# EAGLE design shema (EAGLE 7.2.0)
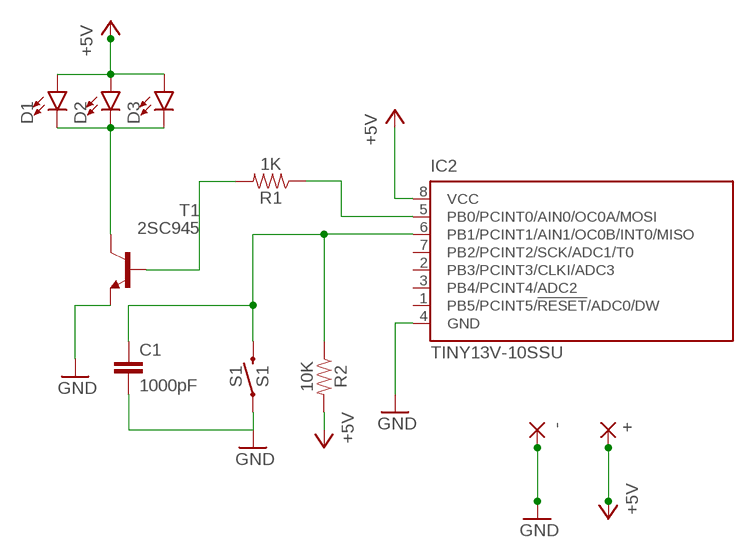
[diagram p0: schematic, sheet 1]

## Parts
+  2,54/0,8  [2,54/0,8]
-  2,54/0,8  [2,54/0,8]
C1  1000pF  560PF-0603-50V-5%  [0603]
D1  LED-3MM-NO_SILK  [LED_3MM-NS]
D2  LED-3MM-NO_SILK  [LED_3MM-NS]
D3  LED-3MM-NO_SILK  [LED_3MM-NS]
IC2  TINY13V-10SSU  [8S1]
R1  1K  2MOHMS-0603-1/10W-1%  [0603]
R2  10K  2MOHMS-0603-1/10W-1%  [0603]
S1  S1  MOMENTARY-SWITCH-SPST-SMD-4.5MM  [TACTILE_SWITCH_SMD_4.5MM]
T1  2SC945  [TO92-ECB]

## Nets
+5V: +.1(P) D1.A D2.A D3.A IC2.8(VCC) R2.2
GND: -.1(P) C1.2 IC2.4(GND) S1.2 S1.3 T1.E
N$1: IC2.5(PB0/PCINT0/AIN0/OC0A/MOSI) R1.1
N$2: C1.1 IC2.6(PB1/PCINT1/AIN1/OC0B/INT0/MISO) R2.1 S1.1 S1.4
N$3: R1.2 T1.B
N$6: D1.K(C) D2.K(C) D3.K(C) T1.C
Unconnected: IC2.1(PB5/PCINT5/!RESET!/ADC0/DW) IC2.2(PB3/PCINT3/CLKI/ADC3) IC2.3(PB4/PCINT4/ADC2) IC2.7(PB2/PCINT2/SCK/ADC1/T0)

## Library data of the parts
+ - = wirepad:2,54/0,8: THROUGH-HOLE PAD
C1 = SparkFun-Capacitors:560PF: 0.56nF/560pF ceramic capacitors A capacitor is a passive two-terminal electrical component used to store electrical energy temporarily in an electric field.; PROD_ID: CAP-08749; VALUE: 560pF
D1-D3 = SparkFun-LED:LED: LED (Generic) Standard schematic elements and footprints for 5mm, 3mm, 1206, and 0603 sized LEDs. Generic LEDs with no color specified.
IC2 = atmel:TINY13: 8-bit AVR Microcontroller with 1K Bytes In-System Programmable Flash Source: http://www.atmel.com/dyn/resources/prod_documents/2535S.pdf; MPN: ATTINY13V-10SSU; OC_FARNELL: 1455135; OC_NEWARK: 58M3773
R1 R2 = SparkFun-Resistors:2MOHMS: 2MΩ resistor A resistor is a passive two-terminal electrical component that implements electrical resistance as a circuit element. Resistors act to reduce current flow, and, at the same time, act to lower voltage levels within circuits. - Wikipedia; PROD_ID: RES-10054; VALUE: 2.0M
S1 = SparkFun-Switches:MOMENTARY-SWITCH-SPST: Momentary Switch (Pushbutton) - SPST Normally-open (NO) SPST momentary switches (buttons, pushbuttons). Variants PTH-12MM - 12mm square, through-hole Momentary Pushbutton Switch - 12mm Square <https://www.sparkfun.com/products/9190> (COM-09190) PTH-6.0MM, PTH-6.0MM-KIT - 6.0mm square, through-hole Mini Pushbutton Switch <https://www.sparkfun.com/products/97> (COM-00097) KIT package intended for soldering kit's - only one side of pads' copper is exposed. PTH-RIGHT-ANGLE-KIT - Right-angle, through-hole Right Angle Tactile Button <https://www.sparkfun.com/products/10791> - Used on SparkFun BigTime Watch Kit <https://www.sparkfun.com/products/11734> SMD-12MM - 12mm square, surface-mount Tactile Button - SMD (12mm) <https://www.sparkfun.com/products/12993> (COM-12993) Used on SparkFun PicoBoard <https://www.sparkfun.com/products/11888> SMD-4.5MM - 4.5mm Square Trackball Switch Used on SparkFun Blackberry Trackballer Breakout <https://www.sparkfun.com/products/13169> SMD-4.6MMX2.8MM - 4.60mm x 2.80mm, surface mount Used on SparkFun SAMD21 Mini Breakout <https://www.sparkfun.com/products/13664> SMD-5.2MM, SMD-5.2-REDUNDANT - 5.2mm square, surface-mount Mini Pushbutton Switch - SMD <https://www.sparkfun.com/products/8720> (COM-08720) Used on Arduino Pro Mini <https://www.sparkfun.com/products/11114> REDUNDANT package connects both switch circuits together SMD-6.0X3.5MM - 6.0 x 3.5mm, surface mount Momentary Reset Switch SMD <https://www.sparkfun.com/products/8229> (COM-08229) SMD-6.2MM-TALL - 6.2mm square, surface mount Tactile Button - SMD (6mm) <https://www.sparkfun.com/products/12992> Used on SparkFun Digital Sandbox <https://www.sparkfun.com/products/12651> SMD-RIGHT-ANGLE - Right-angle, surface mount Used on SparkFun Block for Intel® Edison - Arduino <https://www.sparkfun.com/products/13036>; PROD_ID: SWCH-09213
T1 = transistor:2SC945: NPN Silicon Epitaxial Planar Transistor Source: SEMTECH ELECTRONICS LTD. ... 2SC945 2.pdf

## Board
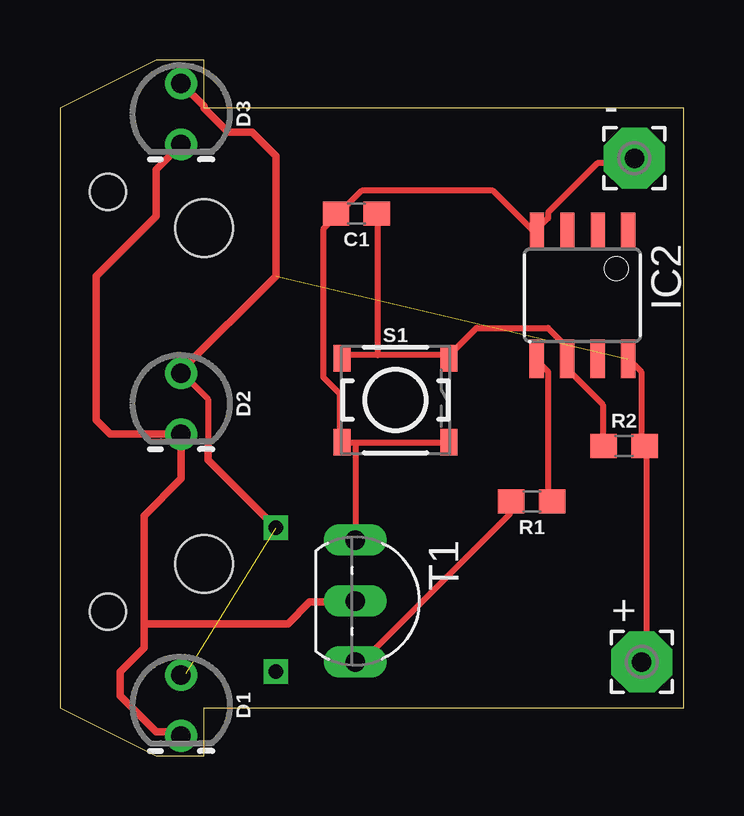
[diagram p1: board, top side]

Size 26 x 29 mm. Coordinates in mm from the lower left corner, seen from the top.
Outline: 0,2 4,0 6,0 6,2 26,2 26,27 6,27 6,29 4,29 0,27 0,2
Copper layers (1*16): Top 0.035mm / dielectric 1.5mm / Bottom 0.035mm
Design rules "default": minimum track width 10mil, minimum drill 24mil, track to track 8mil, track to pad 8mil, pad to pad 8mil, via to via 8mil, smd to smd 8mil, copper to edge 40mil, drill to drill 8mil, minimum pad ring 10mil, minimum via ring 8mil, stop-mask expansion 4mil, vias tented up to drill 0mil, thermal gap 10mil
Holes 2.4 mm at 6,22 6,8
Holes 1.5 mm at 2,23.5 2,6

### Footprints (pad centres in the part's own frame; a part is rotated, then mirrored left to right if it is on the bottom)
2,54/0,8 = drill 0.813 pad 2.54 octagon: 1 0,0
0603 = smd 1.1 x 1: 1 -0.85,0; 2 0.85,0
LED_3MM-NS = drill 0.813: A -1.27,0; K 1.27,0
8S1 = smd 0.6 x 1.6: 1 -1.905,-2.654; 2 -0.645,-2.654; 3 0.625,-2.654; 4 1.895,-2.654; 5 1.905,2.654; 6 0.635,2.654; 7 -0.635,2.654; 8 -1.905,2.654
TACTILE_SWITCH_SMD_4.5MM = smd 0.7 x 1.1: 1 2.225,1.75; 2 2.225,-1.75; 3 -2.225,-1.75; 4 -2.225,1.75
TO92-ECB = drill 0.813 long: B 2.54,0; C 0,0; E -2.54,0

### Placement (x,y rotation side)
+  24.26,3.9 0 top
-  23.95,24.9 0 top
C1  12.36,22.6 180 top
D1  5.05,2.09 270 top
D2  5.05,14.67 270 top
D3  5.05,26.75 270 top
IC2  21.78,19.19 180 top
R1  19.67,10.6 180 top
R2  23.52,12.9 0 top
S1  13.99,14.82 0 top
T1  12.31,6.44 270 top

### Tracks (layer width: path | path; a pad name or v marks a point on that pad's centre or on a via)
+5V  (2 unrouted)
  Top 0.254: 6.17,13.03 6.17,14.86 5.26,15.77 D2.A | 5.26,3.43 D1.A | IC2.8 23.77,16.46 24.23,16 24.23,13.03 R2.2 24.46,12.8 24.46,4.12 +.1
  Top 0.305: D2.A 5.05,16.05 9,20 9,25 8,26 7,26 6,27 6,27.07 D3.A | 6.17,13.03 6.17,12.33 9,9.5
GND
  Top 0.254: 12.34,13.03 16,13.03 S1.2 | 12.34,13.03 11.89,13.03 S1.3 11.66,13.26 11.66,15.09 10.97,15.77 10.97,21.95 11.43,22.4 C1.2 11.66,22.63 12.57,23.55 18.06,23.55 19.66,21.95 IC2.4 19.89,21.95 20.34,22.4 20.34,22.63 22.4,24.69 23.77,24.69 -.1 | 12.34,13.03 12.34,9.14 T1.E
N$1
  Top 0.254: R1.1 20.34,10.74 20.34,16 19.89,16.46 IC2.5
N$2
  Top 0.254: R2.1 22.63,13.03 22.63,14.63 21.26,16 21.26,16.46 IC2.6 21.03,16.69 21.03,17.14 20.34,17.83 17.37,17.83 16.23,16.69 S1.1 16,16.69 13.26,16.69 | 13.26,16.69 11.89,16.69 S1.4 | 13.26,16.69 13.26,22.4 C1.1
N$3
  Top 0.254: R1.2 18.75,10.52 18.75,10.06 12.8,4.12 12.34,4.12 T1.B
N$4  (via drill 0.6)
  other vias: 9,3.5
N$5  (via drill 0.6)
  other vias: 9,9.5
N$6
  Top 0.254: 5.26,13.26 D2.K | 12.12,6.4 T1.C
  Top 0.305: 3.5,5.5 3.5,10 5.05,11.55 D2.K 2.1,13.4 1.5,14 1.5,20 4,22.5 4,24.43 D3.K | 3.5,5.5 3.5,4.5 2.5,3.5 2.5,2.5 4,1 4.87,1 D1.K | 12.12,6.4 10.4,6.4 9.5,5.5 3.5,5.5